# EAGLE schematic 24x16_RGB_ATXMega (EAGLE 6.5.0)

## Sheet 1 of 8
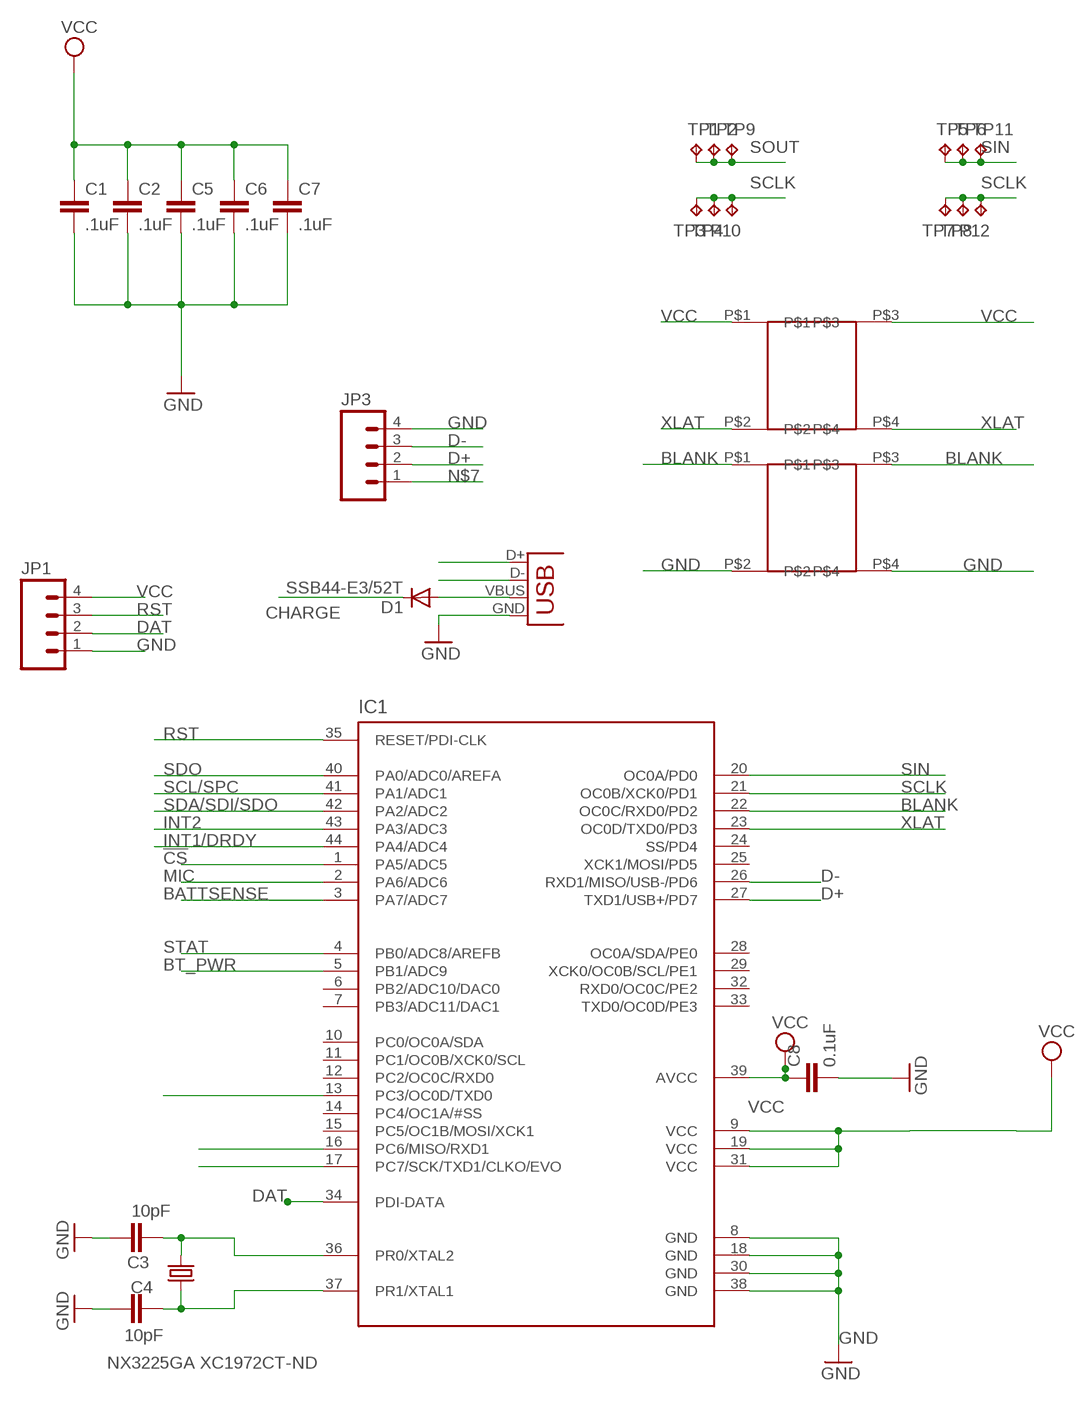
[diagram p0: schematic, sheet 1]

### Parts
C1  .1uF  CAP0805  [0805]
C2  .1uF  CAP0805  [0805]
C3  10pF  CAP0805  [0805]
C4  10pF  CAP0805  [0805]
C5  .1uF  CAP0805  [0805]
C6  .1uF  CAP0805  [0805]
C7  .1uF  CAP0805  [0805]
C8  0.1uF  CAP0805  [0805]
D1  SSB44-E3/52T  DIODE-DO214AA  [DO214AA]
IC1  NONOLITH_ATXMEGAXXA4U-AU  [NONOLITH_TQFP-44]
JP1  M04PTH  [1X04]
JP2  USBSMD  [USB-MINIB]
JP3  M041.27MM  [1X04-1.27MM]
SLOT1  SLOT  [SLOT]
SLOT2  SLOT  [SLOT]
TP1  TPTP20SQ  [TP20SQ]
TP2  TPTP20SQ  [TP20SQ]
TP3  TPTP20SQ  [TP20SQ]
TP4  TPTP20SQ  [TP20SQ]
TP5  TPTP20SQ  [TP20SQ]
TP6  TPTP20SQ  [TP20SQ]
TP7  TPTP20SQ  [TP20SQ]
TP8  TPTP20SQ  [TP20SQ]
TP9  TPTP20SQ  [TP20SQ]
TP10  TPTP20SQ  [TP20SQ]
TP11  TPTP20SQ  [TP20SQ]
TP12  TPTP20SQ  [TP20SQ]
X1  NX3225GA XC1972CT-ND  NX3225GA  [NX3225GA]

### Nets
!CS: IC1.1(PA5/ADC5) ; also sheet 6
BATTSENSE: IC1.3(PA7/ADC7) ; also sheet 4
BLANK: IC1.22(OC0C/RXD0/PD2) SLOT2.P$1 SLOT2.P$3 ; also sheet 2
BT_PWR: IC1.5(PB1/ADC9) ; also sheet 5
BUTTON: IC1.13(PC3/OC0D/TXD0) ; also sheet 6
CHARGE: D1.C ; also sheet 4
D+: IC1.27(TXD1/USB+/PD7) JP2.D+ JP3.2
D-: IC1.26(RXD1/MISO/USB-/PD6) JP2.D- JP3.3
DAT: IC1.34(PDI-DATA) JP1.2
GND: C1.2 C2.2 C3.1 C4.1 C5.2 C6.2 C7.2 C8.2 IC1.8(GND) IC1.18(GND) IC1.30(GND) IC1.38(GND) JP1.1 JP2.GND JP3.4 SLOT2.P$2 SLOT2.P$4 ; also sheet 2,4,5,6,7
INT1/DRDY: IC1.44(PA4/ADC4) ; also sheet 6
INT2: IC1.43(PA3/ADC3) ; also sheet 6
MIC: IC1.2(PA6/ADC6) ; also sheet 7
N$7: D1.A JP2.VBUS JP3.1
N$36: C3.2 IC1.36(PR0/XTAL2) X1.3
N$37: C4.2 IC1.37(PR1/XTAL1) X1.1
RST: IC1.35(RESET/PDI-CLK) JP1.3 ; also sheet 6
RX: IC1.16(PC6/MISO/RXD1) ; also sheet 5
SCL/SPC: IC1.41(PA1/ADC1) ; also sheet 6
SCLK: IC1.21(OC0B/XCK0/PD1) TP3.TP TP4.TP TP7.TP TP8.TP TP10.TP TP12.TP ; also sheet 2
SDA/SDI/SDO: IC1.42(PA2/ADC2) ; also sheet 6
SDO: IC1.40(PA0/ADC0/AREFA) ; also sheet 6
SIN: IC1.20(OC0A/PD0) TP5.TP TP6.TP TP11.TP ; also sheet 2
SOUT: TP1.TP TP2.TP TP9.TP ; also sheet 2
STAT: IC1.4(PB0/ADC8/AREFB) ; also sheet 4
TX: IC1.17(PC7/SCK/TXD1/CLKO/EVO) ; also sheet 5
VCC: C1.1 C2.1 C5.1 C6.1 C7.1 C8.1 IC1.9(VCC) IC1.19(VCC) IC1.31(VCC) IC1.39(AVCC) JP1.4 SLOT1.P$1 SLOT1.P$3 ; also sheet 2,3,4,5,6,7
XLAT: IC1.23(OC0D/TXD0/PD3) SLOT1.P$2 SLOT1.P$4 ; also sheet 2
Unconnected: IC1.6(PB2/ADC10/DAC0) IC1.7(PB3/ADC11/DAC1) IC1.10(PC0/OC0A/SDA) IC1.11(PC1/OC0B/XCK0/SCL) IC1.12(PC2/OC0C/RXD0) IC1.14(PC4/OC1A/#SS) IC1.15(PC5/OC1B/MOSI/XCK1) IC1.24(SS/PD4) IC1.25(XCK1/MOSI/PD5) IC1.28(OC0A/SDA/PE0) IC1.29(XCK0/OC0B/SCL/PE1) IC1.32(RXD0/OC0C/PE2) IC1.33(TXD0/OC0D/PE3)

## Sheet 2 of 8
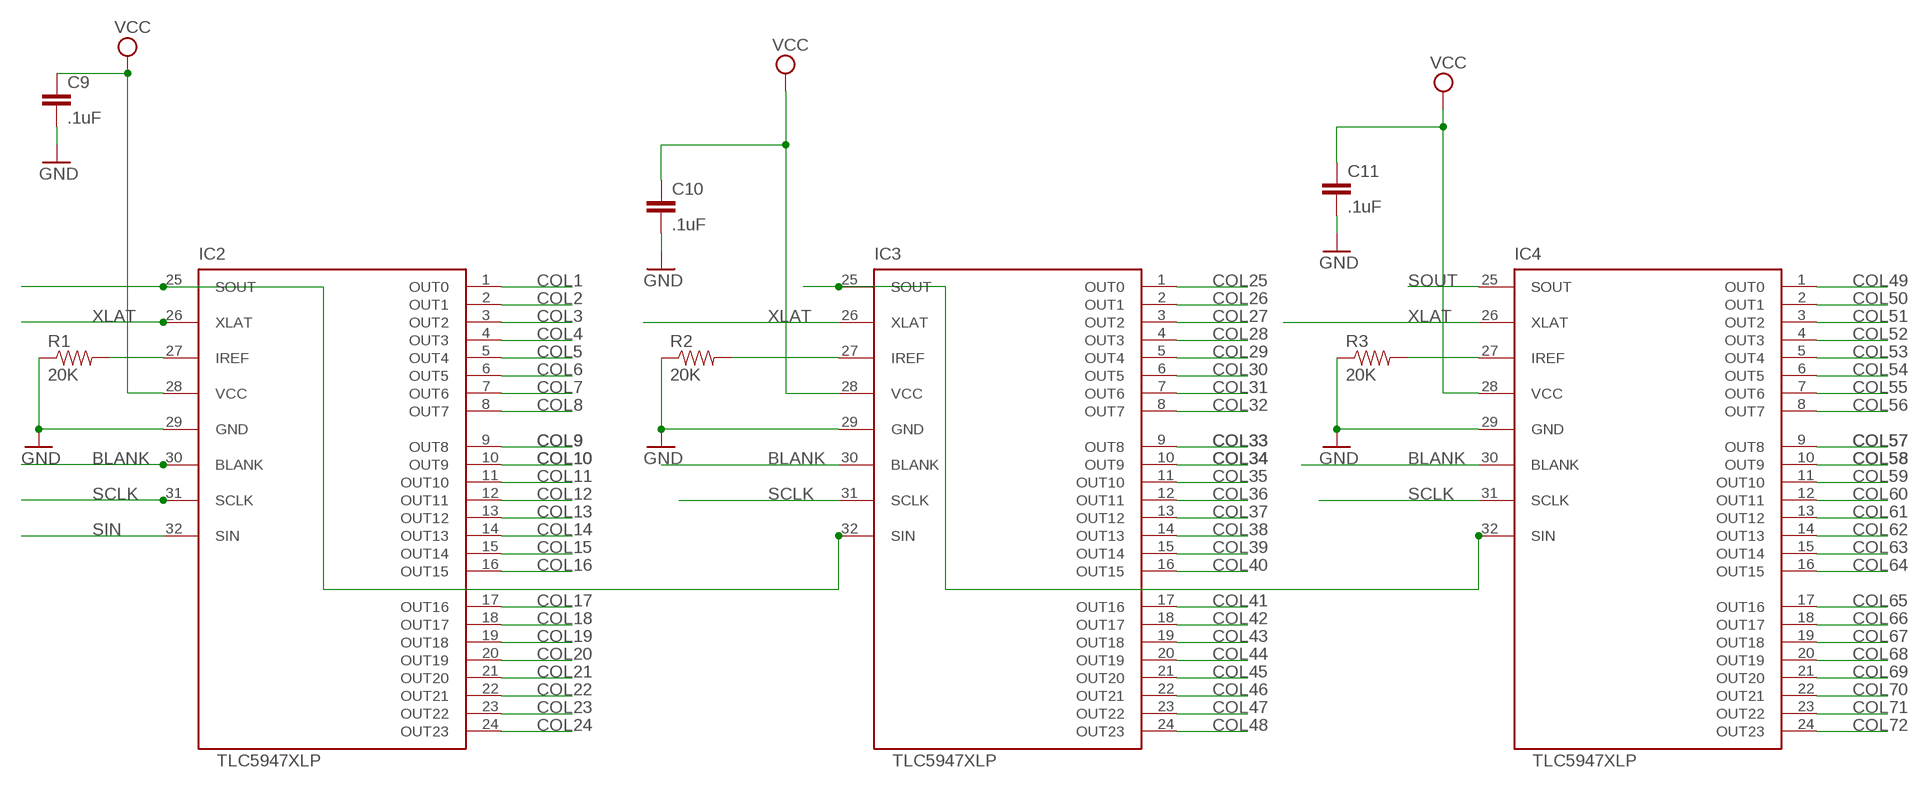
[diagram p1: schematic, sheet 2]

### Parts
C9  .1uF  CAP0805  [0805]
C10  .1uF  CAP0805  [0805]
C11  .1uF  CAP0805  [0805]
IC2  TLC5947XLP  [QFN32_XLP]
IC3  TLC5947XLP  [QFN32_XLP]
IC4  TLC5947XLP  [QFN32_XLP]
R1  20K  RESISTOR  [0805]
R2  20K  RESISTOR  [0805]
R3  20K  RESISTOR  [0805]

### Nets
BLANK: IC2.30(BLANK) IC3.30(BLANK) IC4.30(BLANK) ; also sheet 1
COL1: IC2.1(OUT0) ; also sheet 3
COL2: IC2.2(OUT1) ; also sheet 3
COL3: IC2.3(OUT2) ; also sheet 3
COL4: IC2.4(OUT3) ; also sheet 3
COL5: IC2.5(OUT4) ; also sheet 3
COL6: IC2.6(OUT5) ; also sheet 3
COL7: IC2.7(OUT6) ; also sheet 3
COL8: IC2.8(OUT7) ; also sheet 3
COL9: IC2.9(OUT8) ; also sheet 3
COL10: IC2.10(OUT9) ; also sheet 3
COL11: IC2.11(OUT10) ; also sheet 3
COL12: IC2.12(OUT11) ; also sheet 3
COL13: IC2.13(OUT12) ; also sheet 3
COL14: IC2.14(OUT13) ; also sheet 3
COL15: IC2.15(OUT14) ; also sheet 3
COL16: IC2.16(OUT15) ; also sheet 3
COL17: IC2.17(OUT16) ; also sheet 3
COL18: IC2.18(OUT17) ; also sheet 3
COL19: IC2.19(OUT18) ; also sheet 3
COL20: IC2.20(OUT19) ; also sheet 3
COL21: IC2.21(OUT20) ; also sheet 3
COL22: IC2.22(OUT21) ; also sheet 3
COL23: IC2.23(OUT22) ; also sheet 3
COL24: IC2.24(OUT23) ; also sheet 3
COL25: IC3.1(OUT0) ; also sheet 3
COL26: IC3.2(OUT1) ; also sheet 3
COL27: IC3.3(OUT2) ; also sheet 3
COL28: IC3.4(OUT3) ; also sheet 3
COL29: IC3.5(OUT4) ; also sheet 3
COL30: IC3.6(OUT5) ; also sheet 3
COL31: IC3.7(OUT6) ; also sheet 3
COL32: IC3.8(OUT7) ; also sheet 3
COL33: IC3.9(OUT8) ; also sheet 3
COL34: IC3.10(OUT9) ; also sheet 3
COL35: IC3.11(OUT10) ; also sheet 3
COL36: IC3.12(OUT11) ; also sheet 3
COL37: IC3.13(OUT12) ; also sheet 3
COL38: IC3.14(OUT13) ; also sheet 3
COL39: IC3.15(OUT14) ; also sheet 3
COL40: IC3.16(OUT15) ; also sheet 3
COL41: IC3.17(OUT16) ; also sheet 3
COL42: IC3.18(OUT17) ; also sheet 3
COL43: IC3.19(OUT18) ; also sheet 3
COL44: IC3.20(OUT19) ; also sheet 3
COL45: IC3.21(OUT20) ; also sheet 3
COL46: IC3.22(OUT21) ; also sheet 3
COL47: IC3.23(OUT22) ; also sheet 3
COL48: IC3.24(OUT23) ; also sheet 3
COL49: IC4.1(OUT0) ; also sheet 3
COL50: IC4.2(OUT1) ; also sheet 3
COL51: IC4.3(OUT2) ; also sheet 3
COL52: IC4.4(OUT3) ; also sheet 3
COL53: IC4.5(OUT4) ; also sheet 3
COL54: IC4.6(OUT5) ; also sheet 3
COL55: IC4.7(OUT6) ; also sheet 3
COL56: IC4.8(OUT7) ; also sheet 3
COL57: IC4.9(OUT8) ; also sheet 3
COL58: IC4.10(OUT9) ; also sheet 3
COL59: IC4.11(OUT10) ; also sheet 3
COL60: IC4.12(OUT11) ; also sheet 3
COL61: IC4.13(OUT12) ; also sheet 3
COL62: IC4.14(OUT13) ; also sheet 3
COL63: IC4.15(OUT14) ; also sheet 3
COL64: IC4.16(OUT15) ; also sheet 3
COL65: IC4.17(OUT16) ; also sheet 3
COL66: IC4.18(OUT17) ; also sheet 3
COL67: IC4.19(OUT18) ; also sheet 3
COL68: IC4.20(OUT19) ; also sheet 3
COL69: IC4.21(OUT20) ; also sheet 3
COL70: IC4.22(OUT21) ; also sheet 3
COL71: IC4.23(OUT22) ; also sheet 3
COL72: IC4.24(OUT23) ; also sheet 3
GND: C9.2 C10.2 C11.2 IC2.29(GND) IC3.29(GND) IC4.29(GND) R1.1 R2.1 R3.1 ; also sheet 1,4,5,6,7
HOLE: IC2.27(IREF) R1.2
N$2: IC3.27(IREF) R2.2
N$3: IC2.25(SOUT) IC3.32(SIN)
N$9: IC4.27(IREF) R3.2
N$19: IC3.25(SOUT) IC4.32(SIN)
SCLK: IC2.31(SCLK) IC3.31(SCLK) IC4.31(SCLK) ; also sheet 1
SIN: IC2.32(SIN) ; also sheet 1
SOUT: IC4.25(SOUT) ; also sheet 1
VCC: C9.1 C10.1 C11.1 IC2.28(VCC) IC3.28(VCC) IC4.28(VCC) ; also sheet 1,3,4,5,6,7
XLAT: IC2.26(XLAT) IC3.26(XLAT) IC4.26(XLAT) ; also sheet 1

## Sheet 3 of 8
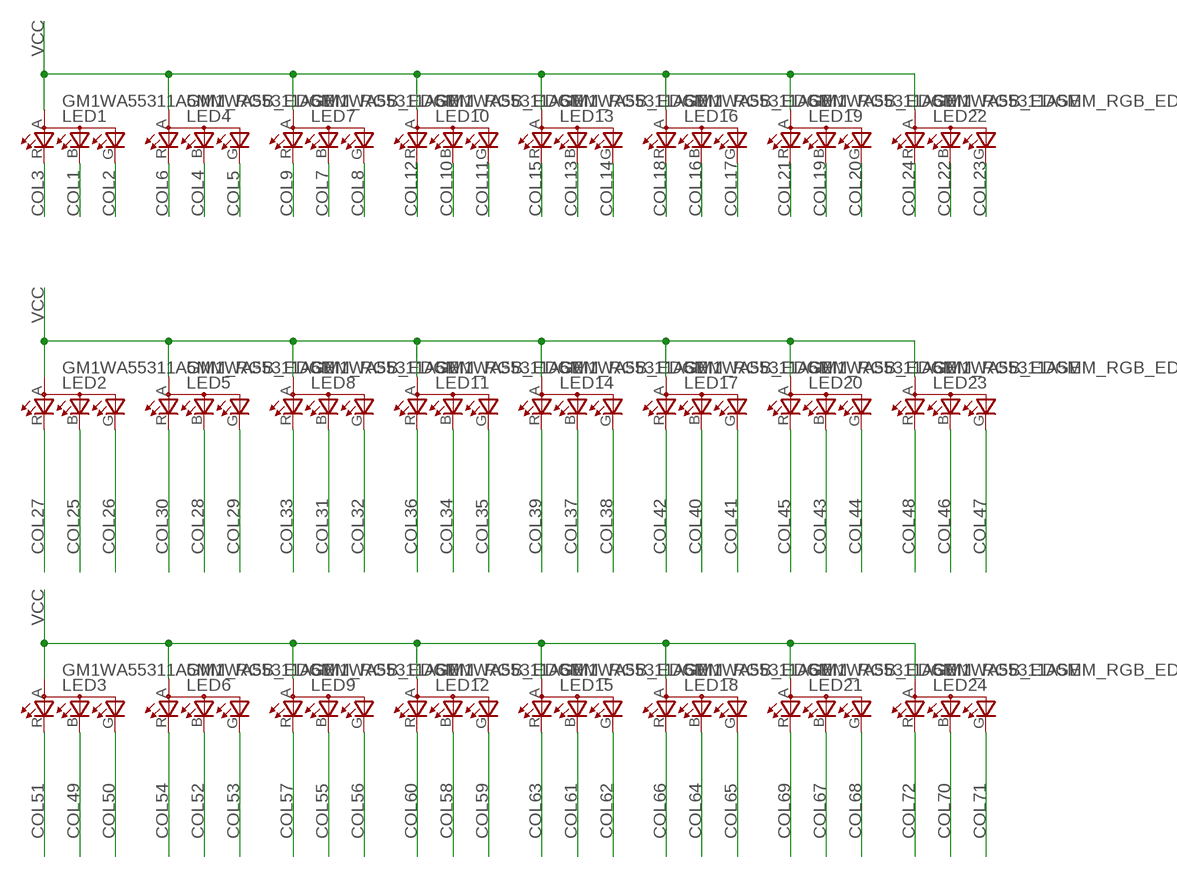
[diagram p2: schematic, sheet 3]

### Parts
LED1  GM1WA55311A5MM_RGB_EDGE  [LED5MM_RGB_EDGE]
LED2  GM1WA55311A5MM_RGB_EDGE  [LED5MM_RGB_EDGE]
LED3  GM1WA55311A5MM_RGB_EDGE  [LED5MM_RGB_EDGE]
LED4  GM1WA55311A5MM_RGB_EDGE  [LED5MM_RGB_EDGE]
LED5  GM1WA55311A5MM_RGB_EDGE  [LED5MM_RGB_EDGE]
LED6  GM1WA55311A5MM_RGB_EDGE  [LED5MM_RGB_EDGE]
LED7  GM1WA55311A5MM_RGB_EDGE  [LED5MM_RGB_EDGE]
LED8  GM1WA55311A5MM_RGB_EDGE  [LED5MM_RGB_EDGE]
LED9  GM1WA55311A5MM_RGB_EDGE  [LED5MM_RGB_EDGE]
LED10  GM1WA55311A5MM_RGB_EDGE  [LED5MM_RGB_EDGE]
LED11  GM1WA55311A5MM_RGB_EDGE  [LED5MM_RGB_EDGE]
LED12  GM1WA55311A5MM_RGB_EDGE  [LED5MM_RGB_EDGE]
LED13  GM1WA55311A5MM_RGB_EDGE  [LED5MM_RGB_EDGE]
LED14  GM1WA55311A5MM_RGB_EDGE  [LED5MM_RGB_EDGE]
LED15  GM1WA55311A5MM_RGB_EDGE  [LED5MM_RGB_EDGE]
LED16  GM1WA55311A5MM_RGB_EDGE  [LED5MM_RGB_EDGE]
LED17  GM1WA55311A5MM_RGB_EDGE  [LED5MM_RGB_EDGE]
LED18  GM1WA55311A5MM_RGB_EDGE  [LED5MM_RGB_EDGE]
LED19  GM1WA55311A5MM_RGB_EDGE  [LED5MM_RGB_EDGE]
LED20  GM1WA55311A5MM_RGB_EDGE  [LED5MM_RGB_EDGE]
LED21  GM1WA55311A5MM_RGB_EDGE  [LED5MM_RGB_EDGE]
LED22  GM1WA55311A5MM_RGB_EDGE  [LED5MM_RGB_EDGE]
LED23  GM1WA55311A5MM_RGB_EDGE  [LED5MM_RGB_EDGE]
LED24  GM1WA55311A5MM_RGB_EDGE  [LED5MM_RGB_EDGE]

### Nets
COL1: LED1.B(CBLUE) ; also sheet 2
COL2: LED1.G(CGREEN) ; also sheet 2
COL3: LED1.R(CRED) ; also sheet 2
COL4: LED4.B(CBLUE) ; also sheet 2
COL5: LED4.G(CGREEN) ; also sheet 2
COL6: LED4.R(CRED) ; also sheet 2
COL7: LED7.B(CBLUE) ; also sheet 2
COL8: LED7.G(CGREEN) ; also sheet 2
COL9: LED7.R(CRED) ; also sheet 2
COL10: LED10.B(CBLUE) ; also sheet 2
COL11: LED10.G(CGREEN) ; also sheet 2
COL12: LED10.R(CRED) ; also sheet 2
COL13: LED13.B(CBLUE) ; also sheet 2
COL14: LED13.G(CGREEN) ; also sheet 2
COL15: LED13.R(CRED) ; also sheet 2
COL16: LED16.B(CBLUE) ; also sheet 2
COL17: LED16.G(CGREEN) ; also sheet 2
COL18: LED16.R(CRED) ; also sheet 2
COL19: LED19.B(CBLUE) ; also sheet 2
COL20: LED19.G(CGREEN) ; also sheet 2
COL21: LED19.R(CRED) ; also sheet 2
COL22: LED22.B(CBLUE) ; also sheet 2
COL23: LED22.G(CGREEN) ; also sheet 2
COL24: LED22.R(CRED) ; also sheet 2
COL25: LED2.B(CBLUE) ; also sheet 2
COL26: LED2.G(CGREEN) ; also sheet 2
COL27: LED2.R(CRED) ; also sheet 2
COL28: LED5.B(CBLUE) ; also sheet 2
COL29: LED5.G(CGREEN) ; also sheet 2
COL30: LED5.R(CRED) ; also sheet 2
COL31: LED8.B(CBLUE) ; also sheet 2
COL32: LED8.G(CGREEN) ; also sheet 2
COL33: LED8.R(CRED) ; also sheet 2
COL34: LED11.B(CBLUE) ; also sheet 2
COL35: LED11.G(CGREEN) ; also sheet 2
COL36: LED11.R(CRED) ; also sheet 2
COL37: LED14.B(CBLUE) ; also sheet 2
COL38: LED14.G(CGREEN) ; also sheet 2
COL39: LED14.R(CRED) ; also sheet 2
COL40: LED17.B(CBLUE) ; also sheet 2
COL41: LED17.G(CGREEN) ; also sheet 2
COL42: LED17.R(CRED) ; also sheet 2
COL43: LED20.B(CBLUE) ; also sheet 2
COL44: LED20.G(CGREEN) ; also sheet 2
COL45: LED20.R(CRED) ; also sheet 2
COL46: LED23.B(CBLUE) ; also sheet 2
COL47: LED23.G(CGREEN) ; also sheet 2
COL48: LED23.R(CRED) ; also sheet 2
COL49: LED3.B(CBLUE) ; also sheet 2
COL50: LED3.G(CGREEN) ; also sheet 2
COL51: LED3.R(CRED) ; also sheet 2
COL52: LED6.B(CBLUE) ; also sheet 2
COL53: LED6.G(CGREEN) ; also sheet 2
COL54: LED6.R(CRED) ; also sheet 2
COL55: LED9.B(CBLUE) ; also sheet 2
COL56: LED9.G(CGREEN) ; also sheet 2
COL57: LED9.R(CRED) ; also sheet 2
COL58: LED12.B(CBLUE) ; also sheet 2
COL59: LED12.G(CGREEN) ; also sheet 2
COL60: LED12.R(CRED) ; also sheet 2
COL61: LED15.B(CBLUE) ; also sheet 2
COL62: LED15.G(CGREEN) ; also sheet 2
COL63: LED15.R(CRED) ; also sheet 2
COL64: LED18.B(CBLUE) ; also sheet 2
COL65: LED18.G(CGREEN) ; also sheet 2
COL66: LED18.R(CRED) ; also sheet 2
COL67: LED21.B(CBLUE) ; also sheet 2
COL68: LED21.G(CGREEN) ; also sheet 2
COL69: LED21.R(CRED) ; also sheet 2
COL70: LED24.B(CBLUE) ; also sheet 2
COL71: LED24.G(CGREEN) ; also sheet 2
COL72: LED24.R(CRED) ; also sheet 2
VCC: LED1.A LED2.A LED3.A LED4.A LED5.A LED6.A LED7.A LED8.A LED9.A LED10.A LED11.A LED12.A LED13.A LED14.A LED15.A LED16.A LED17.A LED18.A LED19.A LED20.A LED21.A LED22.A LED23.A LED24.A ; also sheet 1,2,4,5,6,7

## Sheet 4 of 8
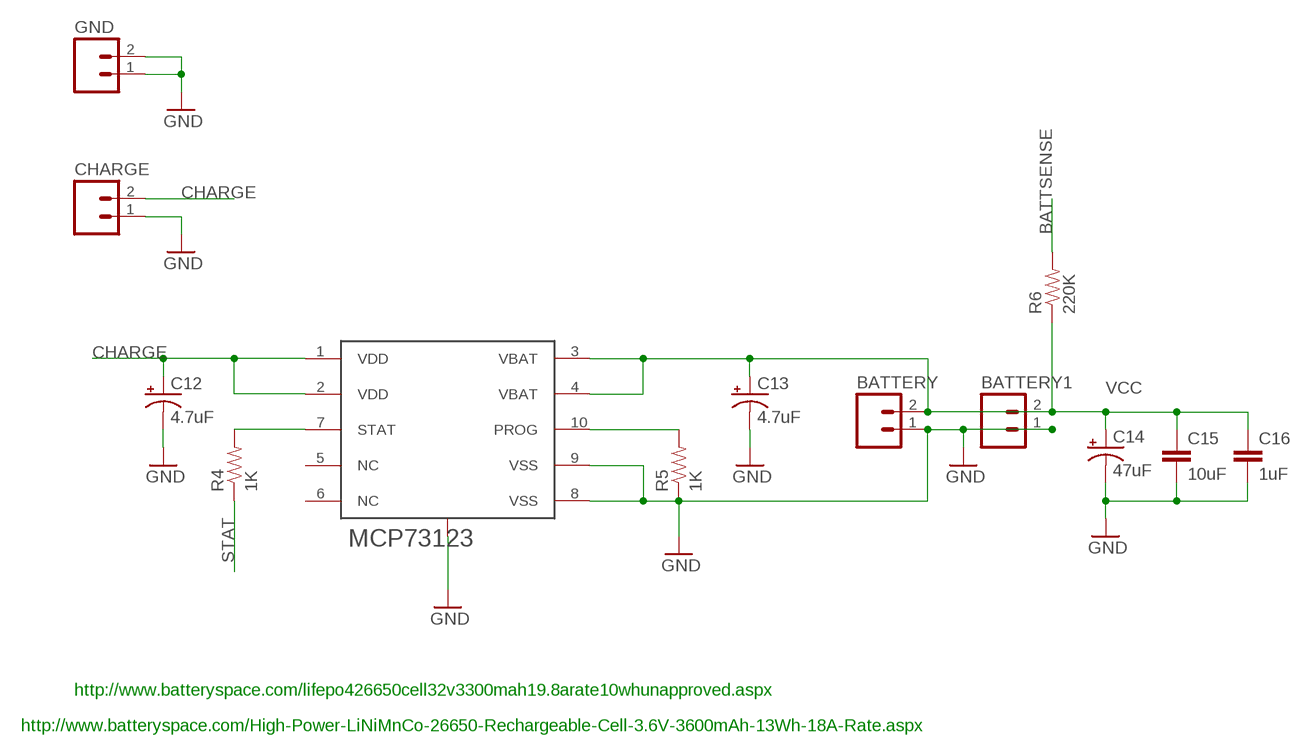
[diagram p3: schematic, sheet 4]

### Parts
BATTERY  M02PTH  [1X02]
BATTERY1  M02PTH  [1X02]
C12  4.7uF  CAP_POL3528  [EIA3528]
C13  4.7uF  CAP_POL3528  [EIA3528]
C14  47uF  CAP_POL3528  [EIA3528]
C15  10uF  CAP0805  [0805]
C16  1uF  CAP0805  [0805]
CHARGE  M02PTH  [1X02]
GND  M02PTH  [1X02]
IC5  MCP73123  [DFN10_3X3]
R4  1K  RESISTOR0805  [0805]
R5  1K  RESISTOR0805  [0805]
R6  220K  RESISTOR0805  [0805]

### Nets
BATTSENSE: R6.2 ; also sheet 1
CHARGE: C12.A(+) CHARGE.2 IC5.1(VDD) IC5.2(VDD) ; also sheet 1
GND: BATTERY1.1 BATTERY.1 C12.C(-) C13.C(-) C14.C(-) C15.2 C16.2 CHARGE.1 GND.1 GND.2 IC5.8(VSS) IC5.9(VSS) IC5.EXP(GND) R5.1 ; also sheet 1,2,5,6,7
N$1: IC5.7(STAT) R4.2
N$6: IC5.10(PROG) R5.2
STAT: R4.1 ; also sheet 1
VCC: BATTERY1.2 BATTERY.2 C13.A(+) C14.A(+) C15.1 C16.1 IC5.3(VBAT) IC5.4(VBAT) R6.1 ; also sheet 1,2,3,5,6,7
Unconnected: IC5.5(NC) IC5.6(NC)

### Notes on the sheet
- http://www.batteryspace.com/lifepo426650cell32v3300mah19.8arate10whunapproved.aspx
- http://www.batteryspace.com/High-Power-LiNiMnCo-26650-Rechargeable-Cell-3.6V-3600mAh-13Wh-18A-Rate.aspx

## Sheet 5 of 8
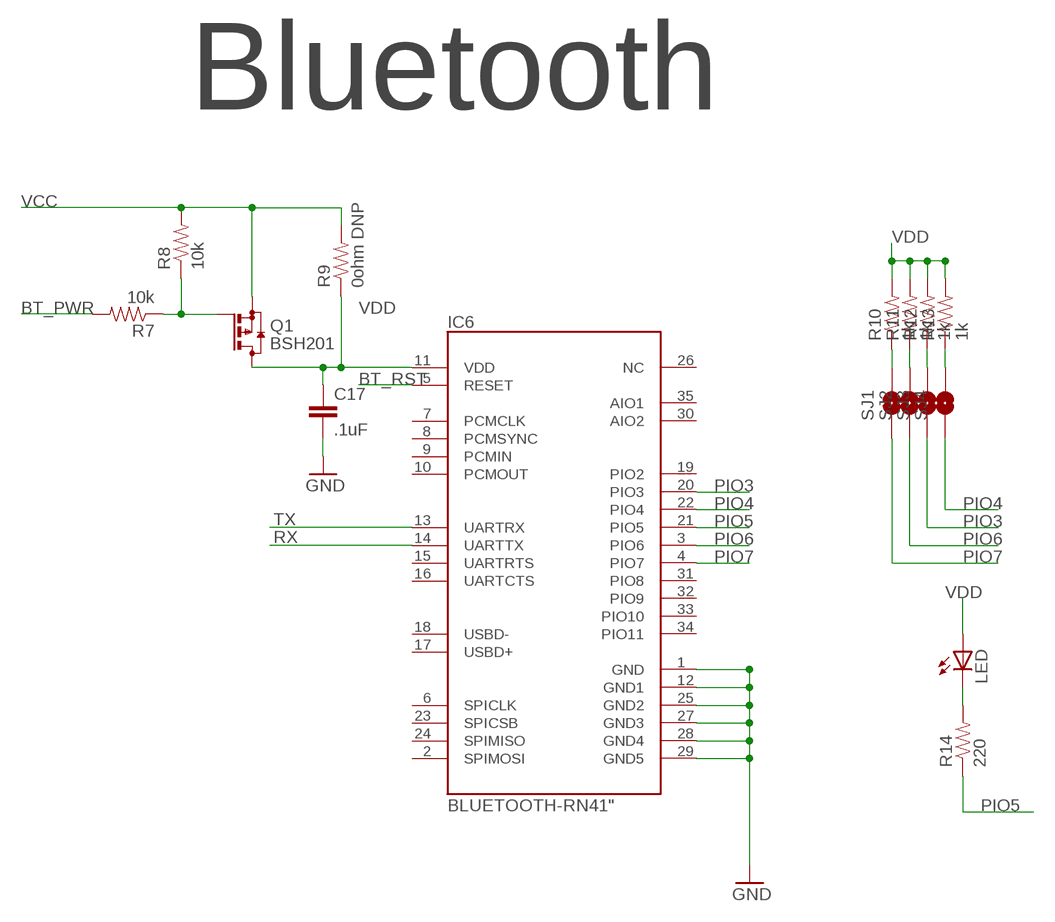
[diagram p4: schematic, sheet 5]

### Parts
C17  .1uF  CAP0805  [0805]
IC6  BLUETOOTH-RN41"  [RN41]
LED  LEDCHIP-LED0603  [CHIP-LED0603]
Q1  BSH201  BSS84  [SOT23]
R7  10k  RESISTOR  [0805]
R8  10k  RESISTOR  [0805]
R9  0ohm DNP  RESISTOR  [0805]
R10  1k  RESISTOR  [0805]
R11  1k  RESISTOR  [0805]
R12  1k  RESISTOR  [0805]
R13  1k  RESISTOR  [0805]
R14  220  RESISTOR  [0805]
SJ1  SOLDERJUMPERNO  [SJ_2S-NO]
SJ2  SOLDERJUMPERNO  [SJ_2S-NO]
SJ3  SOLDERJUMPERNO  [SJ_2S-NO]
SJ4  SOLDERJUMPERNO  [SJ_2S-NO]

### Nets
BT_PWR: R7.2 ; also sheet 1
BT_RST: IC6.5(RESET) ; also sheet 6
GND: C17.2 IC6.1(GND) IC6.12(GND1) IC6.25(GND2) IC6.27(GND3) IC6.28(GND4) IC6.29(GND5) ; also sheet 1,2,4,6,7
N$4: LED.C R14.2
N$5: R10.1 SJ1.2
N$18: Q1.1(G) R7.1 R8.1
N$21: R12.1 SJ3.2
N$23: R11.1 SJ2.2
N$24: R13.1 SJ4.2
PIO3: IC6.20(PIO3) SJ3.1
PIO4: IC6.22(PIO4) SJ4.1
PIO5: IC6.21(PIO5) R14.1
PIO6: IC6.3(PIO6) SJ2.1
PIO7: IC6.4(PIO7) SJ1.1
RX: IC6.14(UARTTX) ; also sheet 1
TX: IC6.13(UARTRX) ; also sheet 1
VCC: Q1.2(S) R8.2 R9.2 ; also sheet 1,2,3,4,6,7
VDD: C17.1 IC6.11(VDD) LED.A Q1.3(D) R9.1 R10.2 R11.2 R12.2 R13.2
Unconnected: IC6.2(SPIMOSI) IC6.6(SPICLK) IC6.7(PCMCLK) IC6.8(PCMSYNC) IC6.9(PCMIN) IC6.10(PCMOUT) IC6.15(UARTRTS) IC6.16(UARTCTS) IC6.17(USBD+) IC6.18(USBD-) IC6.19(PIO2) IC6.23(SPICSB) IC6.24(SPIMISO) IC6.26(NC) IC6.30(AIO2) IC6.31(PIO8) IC6.32(PIO9) IC6.33(PIO10) IC6.34(PIO11) IC6.35(AIO1)

### Notes on the sheet
- Bluetooth

## Sheet 6 of 8
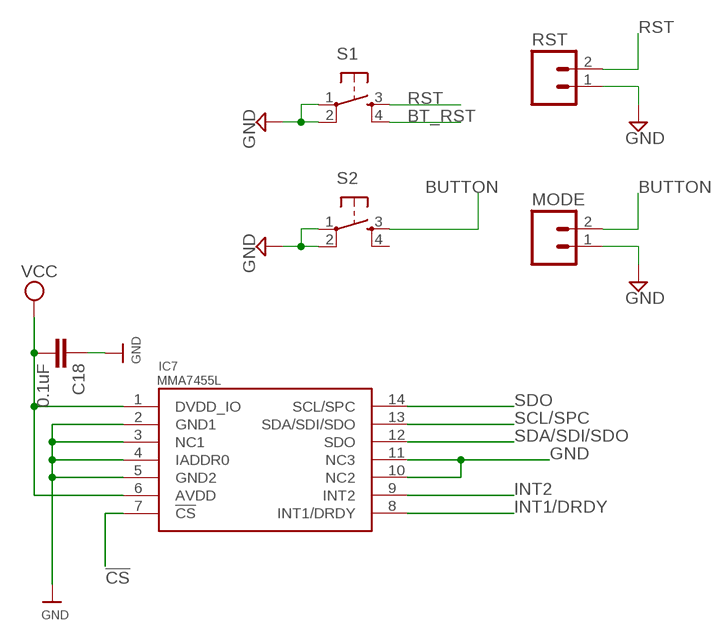
[diagram p5: schematic, sheet 6]

### Parts
C18  0.1uF  CAP0805  [0805]
IC7  MMA7455L  [LGA-14]
MODE  M02PTH  [1X02]
RST  M02PTH  [1X02]
S1  TAC_SWITCHSMD  [TACTILE_SWITCH_SMD]
S2  TAC_SWITCHSMD  [TACTILE_SWITCH_SMD]

### Nets
!CS: IC7.7(!CS) ; also sheet 1
BT_RST: S1.4 ; also sheet 5
BUTTON: MODE.2 S2.3 ; also sheet 1
GND: C18.1 IC7.2(GND1) IC7.3(NC1) IC7.4(IADDR0) IC7.5(GND2) IC7.10(NC2) IC7.11(NC3) MODE.1 RST.1 S1.1 S1.2 S2.1 S2.2 ; also sheet 1,2,4,5,7
INT1/DRDY: IC7.8(INT1/DRDY) ; also sheet 1
INT2: IC7.9(INT2) ; also sheet 1
RST: RST.2 S1.3 ; also sheet 1
SCL/SPC: IC7.13(SDA/SDI/SDO) ; also sheet 1
SDA/SDI/SDO: IC7.12(SDO) ; also sheet 1
SDO: IC7.14(SCL/SPC) ; also sheet 1
VCC: C18.2 IC7.1(DVDD_IO) IC7.6(AVDD) ; also sheet 1,2,3,4,5,7
Unconnected: S2.4

## Sheet 7 of 8
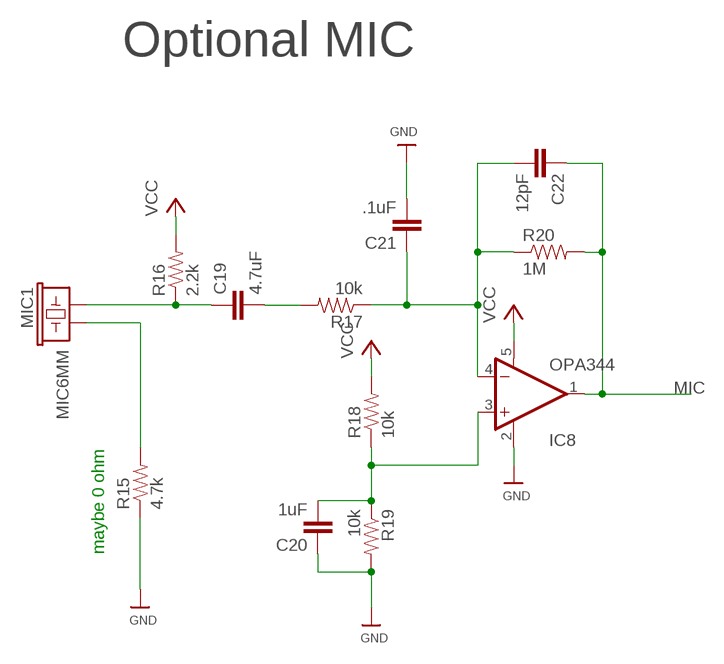
[diagram p6: schematic, sheet 7]

### Parts
C19  4.7uF  CAP0805  [0805]
C20  1uF  CAP0805  [0805]
C21  .1uF  CAP0805  [0805]
C22  12pF  CAP0805  [0805]
IC8  OPA344  [SOT23-5]
MIC1  MIC6MM  [MIC-6MM]
R15  4.7k  RESISTOR  [0805]
R16  2.2k  RESISTOR  [0805]
R17  10k  RESISTOR  [0805]
R18  10k  RESISTOR  [0805]
R19  10k  RESISTOR  [0805]
R20  1M  RESISTOR  [0805]

### Nets
GND: C20.1 C21.2 IC8.2(V-) R15.1 R19.2 ; also sheet 1,2,4,5,6
MIC: C22.1 IC8.1(OUT) R20.2 ; also sheet 1
N$14: C19.2 R17.2
N$15: C19.1 MIC1.1 R16.1
N$16: C20.2 IC8.3(+IN) R18.1 R19.1
N$17: C21.1 C22.2 IC8.4(-IN) R17.1 R20.1
N$20: MIC1.2 R15.2
VCC: IC8.5(V+) R16.2 R18.2 ; also sheet 1,2,3,4,5,6

### Notes on the sheet
- Optional MIC
- maybe 0 ohm

## Sheet 8 of 8
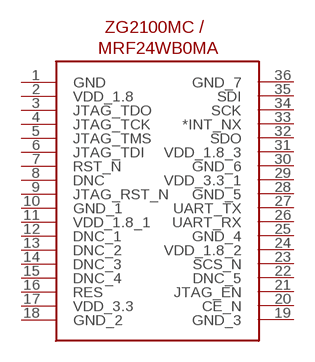
[diagram p7: schematic, sheet 8]

### Parts
U$5  ZG2100MC  [ZG2100MC]
Unconnected: U$5.1(GND) U$5.2(VDD_1.8) U$5.3(JTAG_TDO) U$5.4(JTAG_TCK) U$5.5(JTAG_TMS) U$5.6(JTAG_TDI) U$5.7(RST_N) U$5.8(DNC) U$5.9(JTAG_RST_N) U$5.10(GND_1) U$5.11(VDD_1.8_1) U$5.12(DNC_1) U$5.13(DNC_2) U$5.14(DNC_3) U$5.15(DNC_4) U$5.16(RES) U$5.17(VDD_3.3) U$5.18(GND_2) U$5.19(GND_3) U$5.20(CE_N) U$5.21(JTAG_EN) U$5.22(DNC_5) U$5.23(SCS_N) U$5.24(VDD_1.8_2) U$5.25(GND_4) U$5.26(UART_RX) U$5.27(UART_TX) U$5.28(GND_5) U$5.29(VDD_3.3_1) U$5.30(GND_6) U$5.31(VDD_1.8_3) U$5.32(SDO) U$5.33(*INT_NX) U$5.34(SCK) U$5.35(SDI) U$5.36(GND_7)

## Power pins joined to a net without a drawn wire
DGND: X1.2(DGND) X1.4(DGND)

## Library data of the parts
BATTERY BATTERY1 CHARGE GND = SparkFun:M02: Header 2 Standard 2-pin 0.1" header. Use with straight break away headers (SKU : PRT-00116), right angle break away headers (PRT-00553), swiss pins (PRT-00743), machine pins (PRT-00117), and female headers (PRT-00115). Molex polarized connector foot print use with SKU : PRT-08233 with associated crimp pins and housings.; OC_NEWARK: unknown
C1 C2 C5-C7 C9-C11 = slice_noshift:CAP: Capacitor Standard 0603 ceramic capacitor, and 0.1" leaded capacitor.; MPN: 08055C105MAT2A; OC_NEWARK: 73T5385
C3 C4 C8 = SparkFun:CAP: Capacitor Standard 0603 ceramic capacitor, and 0.1" leaded capacitor.
C12 C13 = slice_noshift:CAP_POL: Capacitor Polarized These are standard SMD and PTH capacitors. Normally 10uF, 47uF, and 100uF in electrolytic and tantalum varieties. Always verify the external diameter of the through hole cap, it varies with capacity, voltage, and manufacturer. The EIA devices should be standard.; MPN: 0805YD475KAT2A; OC_NEWARK: 96M1306
C14 = slice_noshift:CAP_POL: Capacitor Polarized These are standard SMD and PTH capacitors. Normally 10uF, 47uF, and 100uF in electrolytic and tantalum varieties. Always verify the external diameter of the through hole cap, it varies with capacity, voltage, and manufacturer. The EIA devices should be standard.; OC_NEWARK: unknown
C15 C16 = 24x16_RGB:CAP: Capacitor Standard 0603 ceramic capacitor, and 0.1" leaded capacitor.; MPN: 08055D105KAT2A; OC_NEWARK: 66M3779
C17 C21 = SparkFun:CAP: Capacitor Standard 0603 ceramic capacitor, and 0.1" leaded capacitor.; MPN: 08055C105MAT2A; OC_NEWARK: 73T5385
C18 = SparkFun:CAP: Capacitor Standard 0603 ceramic capacitor, and 0.1" leaded capacitor.; MPN: 08055C104K4T2A; OC_NEWARK: 95W2729
C19 = SparkFun:CAP: Capacitor Standard 0603 ceramic capacitor, and 0.1" leaded capacitor.; MPN: 08053D475KAT2A; OC_NEWARK: 15P4053
C20 = SparkFun:CAP: Capacitor Standard 0603 ceramic capacitor, and 0.1" leaded capacitor.; MPN: 08055D105KAT2A; OC_NEWARK: 66M3779
C22 = SparkFun:CAP: Capacitor Standard 0603 ceramic capacitor, and 0.1" leaded capacitor.; MF: AVX CORPORATION; MPN: 08055A120JAT2A; OC_NEWARK: 30H0781
D1 = diode:DIODE-: DIODE
IC1 = Outline:NONOLITH_ATXMEGAXXA4U: ATXMEGA A4U Series (XMEGA+USB)
IC2-IC4 = slice_noshift:TLC5947; OC_NEWARK: unknown
IC5 = 24x16_RGB:MCP73123; MPN: MCP73123T-22SI/MF; OC_NEWARK: 14R8877
IC6 = NSL_Mini_Quad:BLUETOOTH-RN41; OC_NEWARK: unknown
IC7 = MMA7455Lbreakoutboard-v1a:MMA7455L; MPN: MMA7455LR2; OC_NEWARK: 69M3900
IC8 = SparkFun:OPA344; MPN: OPA344NA/250G4; OC_NEWARK: 13M5179
JP1 JP3 = SparkFun-Connectors:M04: Header 4 Standard 4-pin 0.1" header. Use with straight break away headers (SKU : PRT-00116), right angle break away headers (PRT-00553), swiss pins (PRT-00743), machine pins (PRT-00117), and female headers (PRT-00115). Molex polarized connector foot print use with SKU : PRT-08231 with associated crimp pins and housings. 1MM SMD Version SKU: PRT-10208
JP2 = SparkFun-Connectors:USB: USB Connectors USB-B-PTH is fully proven SKU : PRT-00139/CONN-08278 USB-miniB is fully proven SKU : PRT-00587 USB-A-PCB is untested. USB-A-H is throughly reviewed, but untested. Spark Fun Electronics SKU : PRT-00437 USB-B-SMT is throughly reviewed, but untested. Needs silkscreen touching up. USB-A-S has not been used/tested USB-MB-H has not been used/tested USB-MICROB has been used. CONN-09505
LED = led:LED: LED OSRAM: - CHIPLED LG R971, LG N971, LY N971, LG Q971, LY Q971, LO R971, LY R971 LH N974, LH R974 LS Q976, LO Q976, LY Q976 LO Q996 - Hyper CHIPLED LW Q18S LB Q993, LB Q99A, LB R99A - SideLED LS A670, LO A670, LY A670, LG A670, LP A670 LB A673, LV A673, LT A673, LW A673 LH A674 LY A675 LS A676, LA A676, LO A676, LY A676, LW A676 LS A679, LY A679, LG A679 - Hyper Micro SIDELED® LS Y876, LA Y876, LO Y876, LY Y876 LT Y87S - SmartLED LW L88C, LW L88S LB L89C, LB L89S, LG L890 LS L89K, LO L89K, LY L89K LS L896, LA L896, LO L896, LY L896 - TOPLED LS T670, LO T670, LY T670, LG T670, LP T670 LSG T670, LSP T670, LSY T670, LOP T670, LYG T670 LG T671, LOG T671, LSG T671 LB T673, LV T673, LT T673, LW T673 LH T674 LS T676, LA T676, LO T676, LY T676, LB T676, LH T676, LSB T676, LW T676 LB T67C, LV T67C, LT T67C, LS T67K, LO T67K, LY T67K, LW E67C LS E67B, LA E67B, LO E67B, LY E67B, LB E67C, LV E67C, LT E67C LW T67C LS T679, LY T679, LG T679 LS T770, LO T770, LY T770, LG T770, LP T770 LB T773, LV T773, LT T773, LW T773 LH T774 LS E675, LA E675, LY E675, LS T675 LS T776, LA T776, LO T776, LY T776, LB T776 LHGB T686 LT T68C, LB T68C - Hyper Mini TOPLED® LB M676 - Mini TOPLED Santana® LG M470 LS M47K, LO M47K, LY M47K Source: http://www.osram.convergy.de LUXEON: - LUMILED® LXK2-PW12-R00, LXK2-PW12-S00, LXK2-PW14-U00, LXK2-PW14-V00 LXK2-PM12-R00, LXK2-PM12-S00, LXK2-PM14-U00 LXK2-PE12-Q00, LXK2-PE12-R00, LXK2-PE12-S00, LXK2-PE14-T00, LXK2-PE14-U00 LXK2-PB12-K00, LXK2-PB12-L00, LXK2-PB12-M00, LXK2-PB14-N00, LXK2-PB14-P00, LXK2-PB14-Q00 LXK2-PR12-L00, LXK2-PR12-M00, LXK2-PR14-Q00, LXK2-PR14-R00 LXK2-PD12-Q00, LXK2-PD12-R00, LXK2-PD12-S00 LXK2-PH12-R00, LXK2-PH12-S00 LXK2-PL12-P00, LXK2-PL12-Q00, LXK2-PL12-R00 Source: www.luxeon.com KINGBRIGHT: KA-3528ASYC Source: www.kingbright.com; OC_NEWARK: unknown
LED1-LED24 = 24x16_RGB:GM1WA55311A: Chip LED RGB Source: http://document.sharpsma.com/files/GM1WA55311A_SS.pdf; OC_NEWARK: unknown
MIC1 = slice_noshift:MIC: Microphone Omni-directional electret microphone. 9.7mm standard diameter.; OC_NEWARK: unknown
MODE RST = 24x16_RGB:M02: Header 2 Standard 2-pin 0.1" header. Use with straight break away headers (SKU : PRT-00116), right angle break away headers (PRT-00553), swiss pins (PRT-00743), machine pins (PRT-00117), and female headers (PRT-00115). Molex polarized connector foot print use with SKU : PRT-08233 with associated crimp pins and housings.; OC_NEWARK: unknown
Q1 = transistor-small-signal:BSS84: P-CHANNEL MOS FET; MPN: BSH201,215; OC_NEWARK: 79R1832
R1-R3 = 24x16_RGB:RESISTOR: Resistor Basic schematic elements and footprints for 0603, 1206, and PTH 1/10th watt (small) resistors.; OC_NEWARK: unknown
R4 = slice_noshift:RESISTOR: Resistor Basic schematic elements and footprints for 0603, 1206, and PTH 1/10th watt (small) resistors.; MF: VISHAY/DALE; MPN: CRCW08051K00FKEA; OC_NEWARK: 52K9723
R5 = slice_noshift:RESISTOR: Resistor Basic schematic elements and footprints for 0603, 1206, and PTH 1/10th watt (small) resistors.; OC_NEWARK: unknown
R6 = slice_noshift:RESISTOR: Resistor Basic schematic elements and footprints for 0603, 1206, and PTH 1/10th watt (small) resistors.; MPN: 08051A220KAT2A; OC_NEWARK: 96M1330
R7-R9 R14 R17-R20 = SparkFun:RESISTOR: Resistor Basic schematic elements and footprints for 0603, 1206, and PTH 1/10th watt (small) resistors.; OC_NEWARK: unknown
R10-R13 = SparkFun:RESISTOR: Resistor Basic schematic elements and footprints for 0603, 1206, and PTH 1/10th watt (small) resistors.; MF: VISHAY/DALE; MPN: CRCW08051K00FKTA; OC_NEWARK: 05F1507
R15 = SparkFun:RESISTOR: Resistor Basic schematic elements and footprints for 0603, 1206, and PTH 1/10th watt (small) resistors.; MPN: CRCW08054K70FKEA; OC_NEWARK: 61M5491
R16 = SparkFun:RESISTOR: Resistor Basic schematic elements and footprints for 0603, 1206, and PTH 1/10th watt (small) resistors.; MPN: CRCW08052K20FKEA; OC_NEWARK: 61M5457
S1 S2 = SparkFun:TAC_SWITCH: Momentary Switch Button commonly used for reset or general input. Spark Fun Electronics SKU : COM-00097; OC_NEWARK: unknown
SJ1-SJ4 = SparkFun:SOLDERJUMPER: Solder Jumper Standard SMD solder jumper. Used to automate production. Two varients : Normally Open and Normally Closed are the same, but have different paste layers. NC will have a large amount of paste and should jumper during reflow.; OC_NEWARK: unknown
SLOT1 SLOT2 = slice:SLOT; OC_NEWARK: unknown
TP1-TP12 = testpad:TP: Test pad; OC_NEWARK: unknown
U$5 = zg2100-mrf24wb0ma:ZG2100MC
X1 = M6-RF315:NX3225GA: NX3225GA Crystal oscillator NDK NX3225GA small surface-mount type crystal unit in compact and thin 3.2 x 2.5 x 0.75 mm package. Source: http://www.ndk.com/images/products/catalog/c_NX3225GA-STD-CRG-1_e.pdf